# Altium schematic sheet miniCUP.SchDoc
size A3
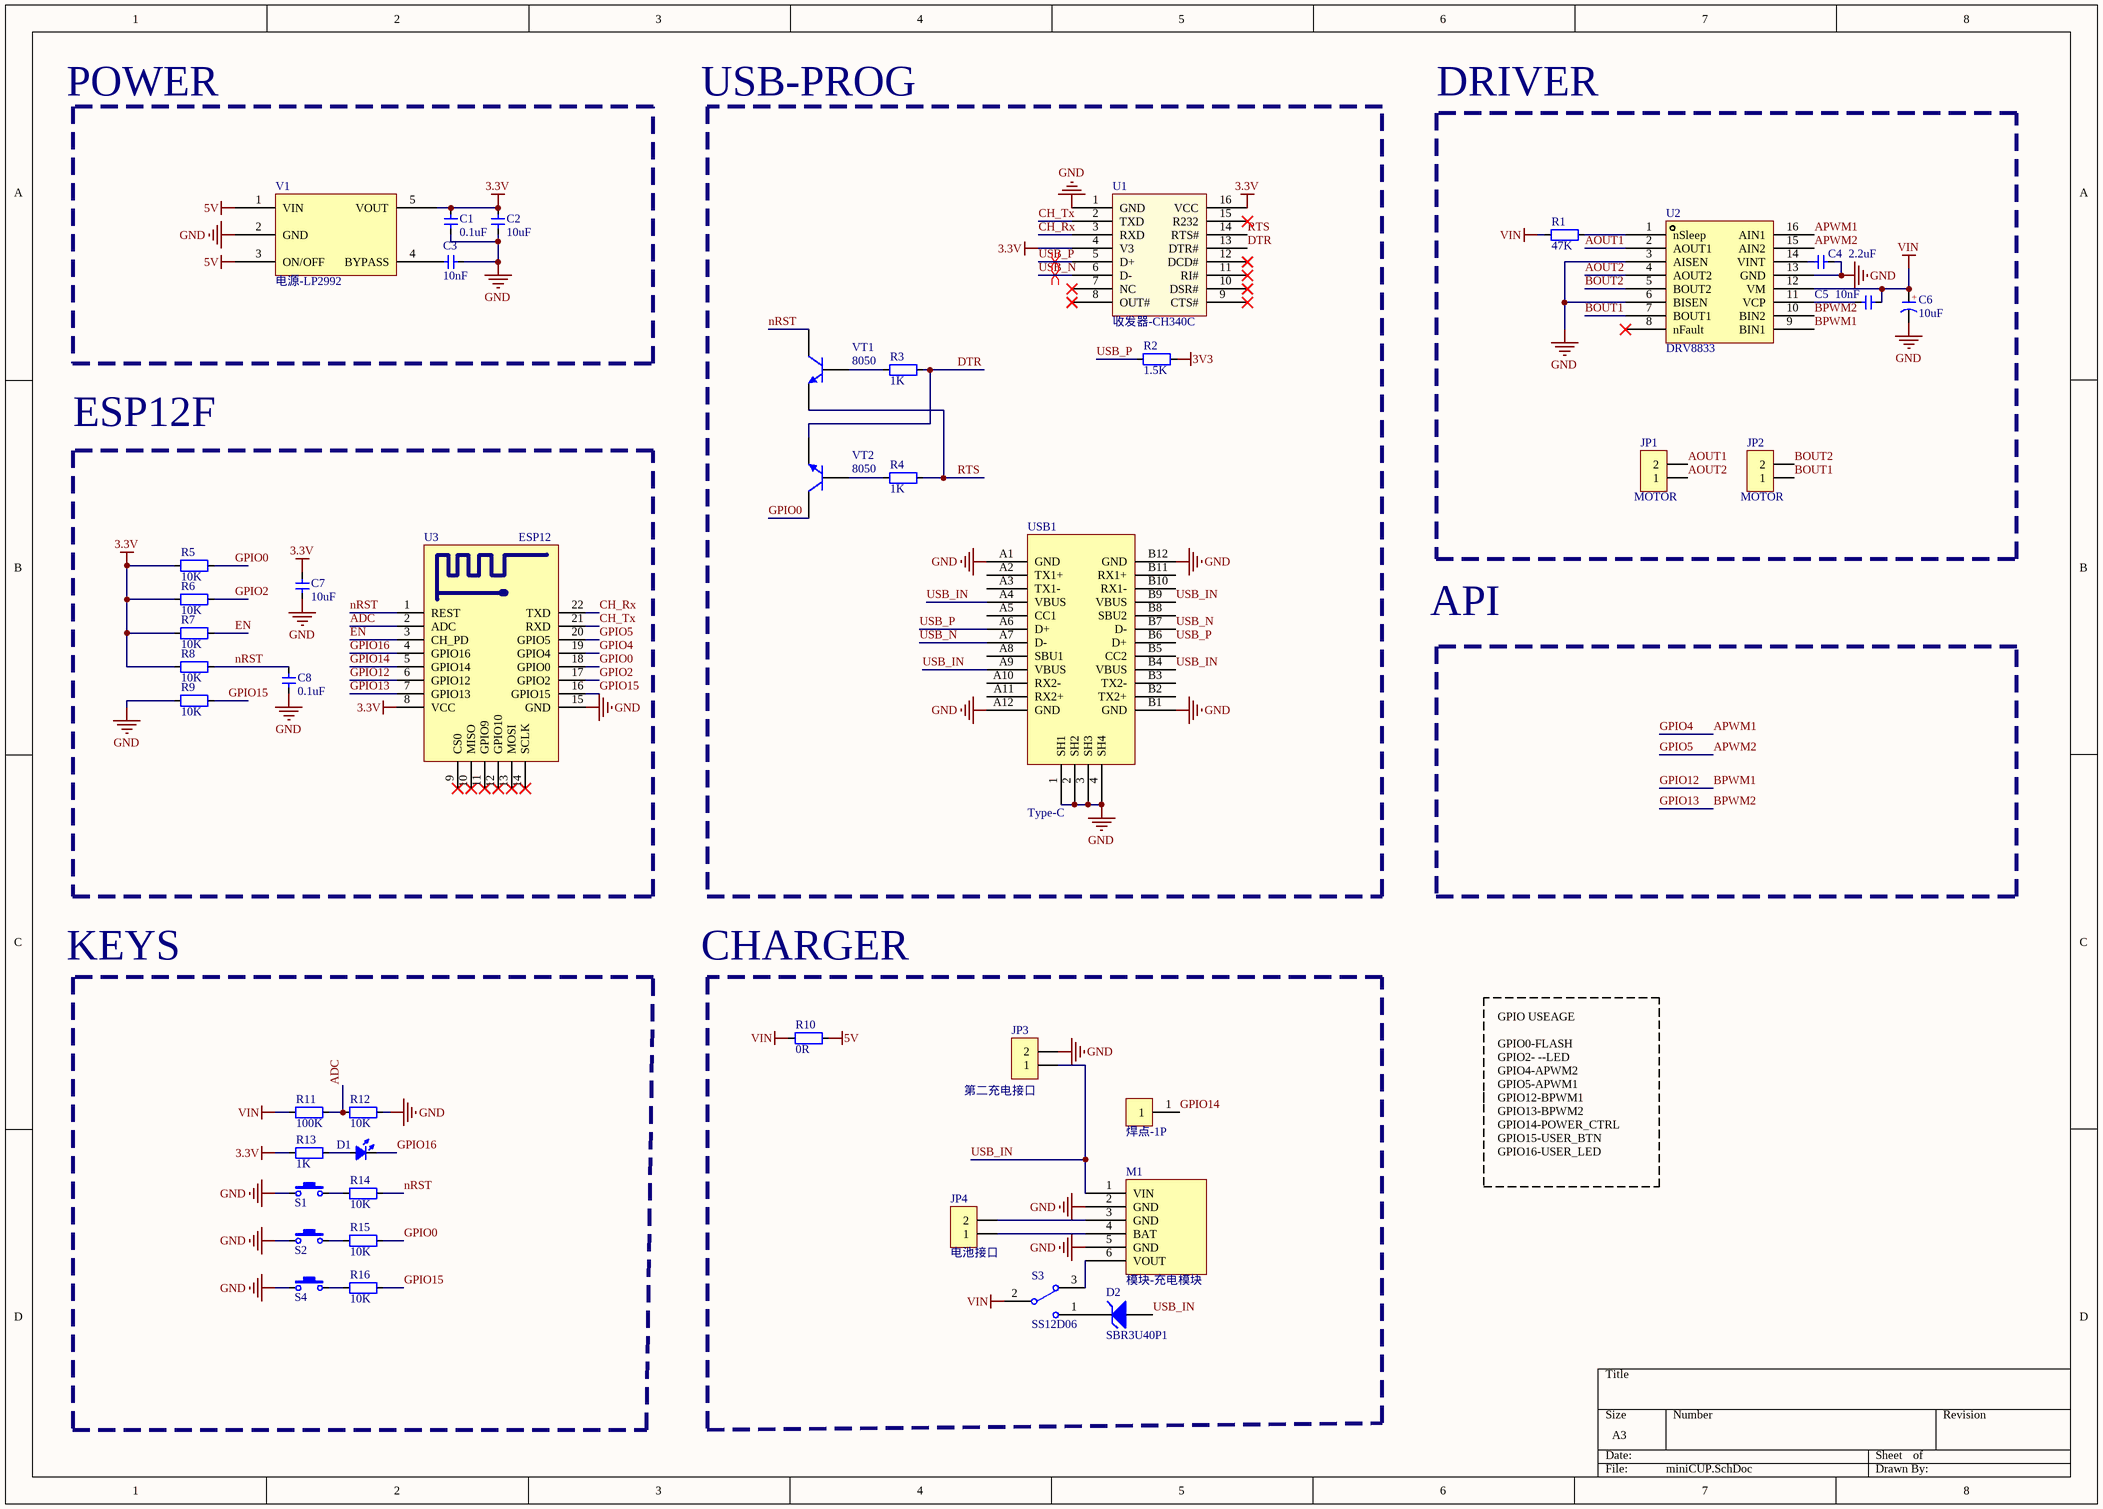
[diagram p0: miniCUP.SchDoc]

## Parts
*1  焊点-1P  [Solder joints]
C1  0.1uF  [0603_CAP]
C2  10uF  [0603_CAP]
C3  10nF  [0603_CAP]
C4  2.2uF  [0603_CAP]
C5  10nF  [0603_CAP]
C6  10uF  [3528-CAP]
C7  10uF  [0603_CAP]
C8  0.1uF  [0603_CAP]
D1  LED-0603  [0603_LED_RED]  (value not drawn)
D2  SBR3U40P1  [D-POWERDI123]
JP1  MOTOR  [J-TIE-2-2.54]
JP2  MOTOR  [J-TIE-2-2.54]
JP3  第二充电接口  [J-TIE-2-2.54]
JP4  电池接口  [J-TIE-2-2.54]
M1  模块-充电模块  [模块-充电模块]
R1  47K  [0603_RES]
R2  1.5K  [0603_RES]
R3  1K  [0603_RES]
R4  1K  [0603_RES]
R5  10K  [0603_RES]
R6  10K  [0603_RES]
R7  10K  [0603_RES]
R8  10K  [0603_RES]
R9  10K  [0603_RES]
R10  0R  [0603_RES]
R11  100K  [0603_RES]
R12  10K  [0603_RES]
R13  1K  [0603_RES]
R14  10K  [0603_RES]
R15  10K  [0603_RES]
R16  10K  [0603_RES]
S1  ButtonTACT_3x4x2_180  [ButtonTACT_3x4x2_180H]  (value not drawn)
S2  ButtonTACT_3x4x2_180  [ButtonTACT_3x4x2_180H]  (value not drawn)
S3  SS12D06  [SWITCH_4.3X8.6]
S4  ButtonTACT_3x4x2_180  [ButtonTACT_3x4x2_180H]  (value not drawn)
U1  收发器-CH340C  [SOIC-16]
U2  DRV8833  [TSSOP16_L]
U3  ESP12  [ESP12]
USB1  Type-C  [Type-C-TOP]
V1  电源-LP2992  [SOT-23-5]
VT1  8050  [SOT-23-3]
VT2  8050  [SOT-23-3]

## Blocks framed on the sheet
DRIVER: C4-C6 JP1 JP2 R1 U2
ESP12F: C7 C8 R5-R9 U3

## Nets
3.3V: C1.2 C2.2 C7.2 R5.1 R6.1 R7.1 R8.1 R13.1 U1.4(V3) U1.16(VCC) U3.8(VCC) V1.5(VOUT)
3V3: R2.2
5V: R10.2 V1.1(VIN) V1.3(ON/OFF)
GND: C1.1 C2.1 C3.1 C4.2 C6.2(K) C7.1 C8.1 JP3.2 M1.2(GND) M1.5(GND) R9.1 R12.2 S1.1 S2.1 S4.1 U1.1(GND) U2.3(AISEN) U2.6(BISEN) U2.13(GND) U3.15(GND) USB1.1(SH1) USB1.2(SH2) USB1.3(SH3) USB1.4(SH4) USB1.A1(GND) USB1.A12(GND) USB1.B1(GND) USB1.B12(GND) V1.2(GND)
VIN: C5.2 C6.1(A) R1.1 R10.1 R11.1 S3.2 U2.12(VM)
ADC: R11.2 R12.1 U3.2(ADC)
AOUT1: JP1.2 U2.2(AOUT1)
AOUT2: JP1.1 U2.4(AOUT2)
APWM1: U2.16(AIN1) U3.19(GPIO4)  [also labelled GPIO4]
APWM2: U2.15(AIN2) U3.20(GPIO5)  [also labelled GPIO5]
BOUT1: JP2.1 U2.7(BOUT1)
BOUT2: JP2.2 U2.5(BOUT2)
BPWM1: U2.9(BIN1) U3.6(GPIO12)  [also labelled GPIO12]
BPWM2: U2.10(BIN2) U3.7(GPIO13)  [also labelled GPIO13]
CH_Rx: U1.3(RXD) U3.22(TXD)
CH_Tx: U1.2(TXD) U3.21(RXD)
DTR: R3.2 U1.13(DTR#) VT2.2(E)
EN: R7.2 U3.3(CH_PD)
GPIO0: R5.2 R15.2 U3.18(GPIO0) VT2.3(C)
GPIO2: R6.2 U3.17(GPIO2)
GPIO14: *1.1 U3.5(GPIO14)
GPIO15: R9.2 R16.2 U3.16(GPIO15)
GPIO16: D1.2(K) U3.4(GPIO16)
nRST: C8.2 R8.2 R14.2 U3.1(REST) VT1.3(C)
RTS: R4.2 U1.14(RTS#) VT1.2(E)
USB_IN: D2.1(A) JP3.1 M1.1(VIN) USB1.A4(VBUS) USB1.A9(VBUS) USB1.B4(VBUS) USB1.B9(VBUS)
USB_N: U1.6(D-) USB1.A7(D-) USB1.B7(D-)
USB_P: R2.1 U1.5(D+) USB1.A6(D+) USB1.B6(D+)
NetC3_2: C3.2 V1.4(BYPASS)
NetC4_1: C4.1 U2.14(VINT)
NetC5_1: C5.1 U2.11(VCP)
NetD1_1: D1.1(A) R13.2
NetD2_2: D2.2(K) S3.1
NetJP4_1: JP4.1 M1.4(BAT)
NetJP4_2: JP4.2 M1.3(GND)
NetM1_6: M1.6(VOUT) S3.3
NetR1_2: R1.2 U2.1(nSleep)
NetR3_1: R3.1 VT1.1(B)
NetR4_1: R4.1 VT2.1(B)
NetR14_1: R14.1 S1.2
NetR15_1: R15.1 S2.2
NetR16_1: R16.1 S4.2

Not connected (* = marked no-connect by the designer): U1 7(NC)* 8(OUT#)* 9(CTS#)* 10(DSR#)* 11(RI#)* 12(DCD#)* 15(R232)*; U2 8(nFault)*; U3 9(CS0)* 10(MISO)* 11(GPIO9)* 12(GPIO10)* 13(MOSI)* 14(SCLK)*; USB1 A2(TX1+) A3(TX1-) A5(CC1) A8(SBU1) A10(RX2-) A11(RX2+) B2(TX2+) B3(TX2-) B5(CC2) B8(SBU2) B10(RX1-) B11(RX1+)

## Layout directives
differential pair: USB_N, USB_P

## Notes on the sheet
- POWER
- USB-PROG
- API
- KEYS
- CHARGER
- GPIO USEAGE
  GPIO0-FLASH
  GPIO2- --LED
  GPIO4-APWM2
  GPIO5-APWM1
  GPIO12-BPWM1
  GPIO13-BPWM2
  GPIO14-POWER_CTRL
  GPIO15-USER_BTN
  GPIO16-USER_LED
- (in symbol 电容-3216) +

## Library data of the parts
*1 = 焊点-1P: 1P
C1 C8 = 电容-0603: 电容; Value: 0.1uF
C2-C5 C7 = 电容-0603: 电容; Value: 0.1uF
C6 = 电容-3216: 钽电容 A型; Published: 8-Jun-2000; LatestRevisionDate: 17-Jul-2002; LatestRevisionNote: Re-released for DXP Platform.; PackageReference: RB7.6-15; Publisher: Altium Limited
D1 = 二极管-0603-RED: 发光二极管
D2 = 二极管-SBR3U40P1: Zener Diode
JP1-JP4 = 接插件-TIE2.54-2P: 2.54MM
R1 R2 R5-R12 R14-R16 = 电阻-0603: 电阻; Value: 1K
R3 R4 R13 = 电阻-0603: 电阻; Value: 1K
S1 S2 S4 = 按键-3x4x2: 3x4x2小龟角按键
S3 = 开关-SS12D06: 2档3脚 大电流拨动开关 弯脚
U1 = 收发器-CH340C: USB转TTL，内置晶振
U2 = 驱动-DRV8833: 2路直流电机驱动
U3 = 通讯模组-ESP12: ESP12系列WIFI模块
USB1 = 接插件-USB-Type-C
V1 = 电源-LP2992: 电源芯片
VT1 VT2 = 三极管-S8050: Published: 8-Jun-2000; LatestRevisionDate: 15-Jan-2003; LatestRevisionNote: PCB Footprint 'BCY-W3/D4.7' replaced; DatasheetDocument: 1997; PackageDocument: Sep-1998; PackageReference: TO-92A; Publisher: Altium Limited; Code_JEDEC: TO-92A; ComponentLink1Description: Manufacturer Link; ComponentLink1URL: http://www.fairchildsemi.com/; ComponentLink2Description: Datasheet; ComponentLink2URL: http://www.fairchildsemi.com/ds/2N%2F2N3904.pdf